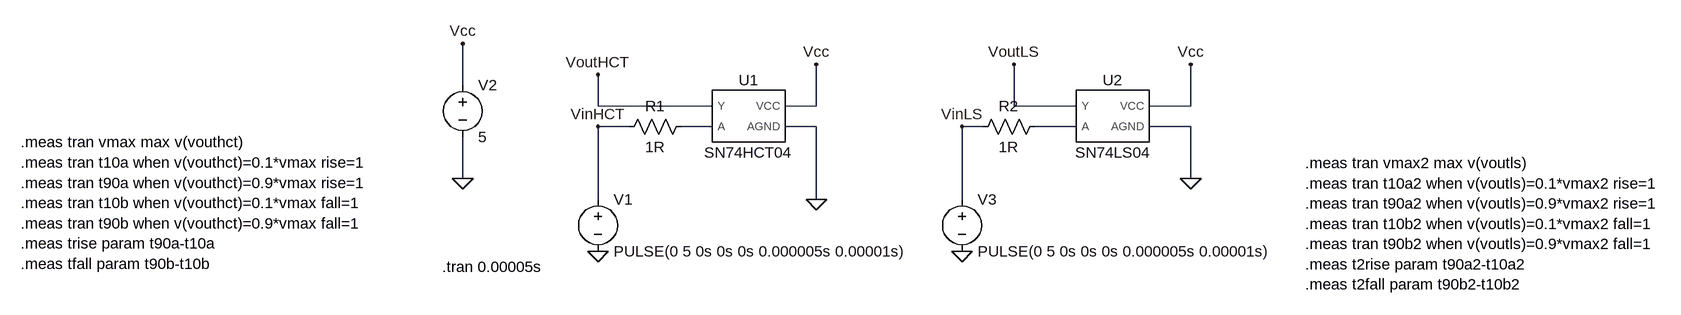
[diagram p0: schematic Lab1.asc]
Lab1.asc, the LTspice schematic file:
Version 4.1
SHEET 1 1604 680
WIRE -304 112 -304 48
WIRE -96 144 -96 96
WIRE 80 144 -96 144
WIRE 240 144 240 80
WIRE 240 144 192 144
WIRE 544 144 544 80
WIRE 640 144 544 144
WIRE 816 144 816 80
WIRE 816 144 752 144
WIRE -48 176 -96 176
WIRE 80 176 32 176
WIRE 240 176 192 176
WIRE 496 176 464 176
WIRE 640 176 576 176
WIRE 816 176 752 176
WIRE -304 256 -304 192
WIRE 816 256 816 176
WIRE -96 288 -96 176
WIRE 240 288 240 176
WIRE 464 288 464 176
FLAG -96 368 0
FLAG -96 176 VinHCT
FLAG -96 96 VoutHCT
FLAG -304 256 0
FLAG -304 48 Vcc
FLAG 240 288 0
FLAG 240 80 Vcc
FLAG 464 368 0
FLAG 464 176 VinLS
FLAG 544 80 VoutLS
FLAG 816 256 0
FLAG 816 80 Vcc
SYMBOL voltage -96 272 R0
WINDOW 123 0 0 Left 0
WINDOW 39 0 0 Left 0
SYMATTR InstName V1
SYMATTR Value PULSE(0 5 0s 0s 0s 0.000005s 0.00001s)
SYMBOL voltage -304 96 R0
WINDOW 123 0 0 Left 0
WINDOW 39 0 0 Left 0
SYMATTR InstName V2
SYMATTR Value 5
SYMBOL voltage 464 272 R0
WINDOW 123 0 0 Left 0
WINDOW 39 0 0 Left 0
SYMATTR InstName V3
SYMATTR Value PULSE(0 5 0s 0s 0s 0.000005s 0.00001s)
SYMBOL SN74HCT04 128 160 R0
SYMATTR InstName U1
SYMBOL SN74LS04 688 160 R0
SYMATTR InstName U2
SYMBOL res 48 160 R90
WINDOW 0 0 56 VBottom 2
WINDOW 3 32 56 VTop 2
SYMATTR InstName R1
SYMATTR Value 1R
SYMBOL res 592 160 R90
WINDOW 0 0 56 VBottom 2
WINDOW 3 32 56 VTop 2
SYMATTR InstName R2
SYMATTR Value 1R
TEXT -336 392 Left 2 !.tran 0.00005s
TEXT -984 200 Left 2 !.meas tran vmax max v(vouthct)\n.meas tran t10a when v(vouthct)=0.1*vmax rise=1\n.meas tran t90a when v(vouthct)=0.9*vmax rise=1\n.meas tran t10b when v(vouthct)=0.1*vmax fall=1\n.meas tran t90b when v(vouthct)=0.9*vmax fall=1\n.meas trise param t90a-t10a\n.meas tfall param t90b-t10b
TEXT 992 232 Left 2 !.meas tran vmax2 max v(voutls)\n.meas tran t10a2 when v(voutls)=0.1*vmax2 rise=1\n.meas tran t90a2 when v(voutls)=0.9*vmax2 rise=1\n.meas tran t10b2 when v(voutls)=0.1*vmax2 fall=1\n.meas tran t90b2 when v(voutls)=0.9*vmax2 fall=1\n.meas t2rise param t90a2-t10a2\n.meas t2fall param t90b2-t10b2

The netlist it stands for:
* Lab1.asc
V1 VinHCT 0 PULSE(0 5 0s 0s 0s 0.000005s 0.00001s)
V2 Vcc 0 5
V3 VinLS 0 PULSE(0 5 0s 0s 0s 0.000005s 0.00001s)
X§U1 VoutHCT N001 Vcc 0 SN74HCT04  ; pins Y A VCC AGND
X§U2 VoutLS N002 Vcc 0 SN74LS04  ; pins Y A VCC AGND
R1 N001 VinHCT 1R
R2 N002 VinLS 1R
.tran 0.00005s
.meas tran vmax max v(vouthct)
.meas tran t10a when v(vouthct)=0.1*vmax rise=1
.meas tran t90a when v(vouthct)=0.9*vmax rise=1
.meas tran t10b when v(vouthct)=0.1*vmax fall=1
.meas tran t90b when v(vouthct)=0.9*vmax fall=1
.meas trise param t90a-t10a
.meas tfall param t90b-t10b
.meas tran vmax2 max v(voutls)
.meas tran t10a2 when v(voutls)=0.1*vmax2 rise=1
.meas tran t90a2 when v(voutls)=0.9*vmax2 rise=1
.meas tran t10b2 when v(voutls)=0.1*vmax2 fall=1
.meas tran t90b2 when v(voutls)=0.9*vmax2 fall=1
.meas t2rise param t90a2-t10a2
.meas t2fall param t90b2-t10b2
.lib C:\Users\sergi\OneDrive\Documents\Universidad\Digital\SN74HCT04.cir
.lib C:\Users\sergi\Downloads\SN74LS04.lib
.backanno
.end

* Results of the author's LTspice run, read from the files saved beside the schematic
* Operating Point, zero values left out:
*   V(vcc) = 5 V
*   V(vouthct) = 5 V
*   V(voutls) = 4.975 V
*   I(V2) = -35.19 µA
*   Ix(u1:vcc) = 10.36 µA
*   Ix(u1:agnd) = -10.36 µA
*   Ix(u2:vcc) = 24.83 µA
*   Ix(u2:agnd) = -24.83 µA
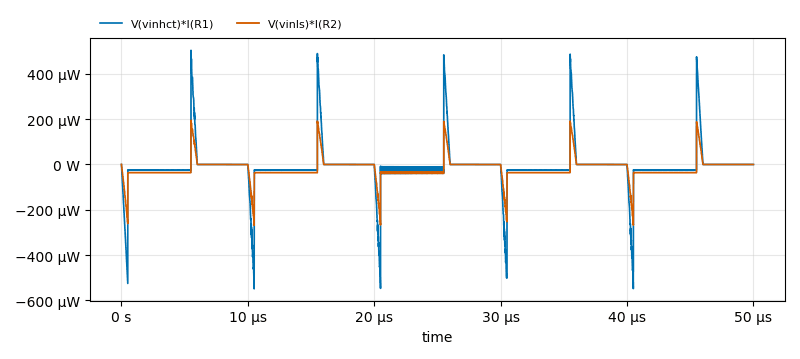
[diagram p1: Transient Analysis of Lab1.asc, plotted from the saved traces]
* Transient Analysis, 1 run:
*   V(vinhct)*I(R1): min -548.8 µW, max 503.5 µW, average -13.5 µW, rms 93.61 µW, last 0 W
*   V(vinls)*I(R2): min -268.7 µW, max 195.1 µW, average -19.44 µW, rms 48.92 µW, last 0 W
* From the log:
*   vmax: MAX(v(vouthct))=4.99986171722 FROM 0 TO 5e-05
*   t10a: v(vouthct)=0.1*vmax AT 5.75833565748e-06
*   t90a: v(vouthct)=0.9*vmax AT 5.76868918618e-06
*   t10b: v(vouthct)=0.1*vmax AT 2.75059493412e-07
*   t90b: v(vouthct)=0.9*vmax AT 2.61931816119e-07
*   trise: t90a-t10a=1.03535287003e-08
*   tfall: t90b-t10b=-1.31276772928e-08
*   vmax2: MAX(v(voutls))=4.97542619705 FROM 0 TO 5e-05
*   t10a2: v(voutls)=0.1*vmax2 AT 5.75833565748e-06
*   t90a2: v(voutls)=0.9*vmax2 AT 5.76868918618e-06
*   t10b2: v(voutls)=0.1*vmax2 AT 2.5817855179e-07
*   t90b2: v(voutls)=0.9*vmax2 AT 2.41280114453e-07
*   t2rise: t90a2-t10a2=1.03535287003e-08
*   t2fall: t90b2-t10b2=-1.68984373378e-08